# EAGLE design memory (EAGLE 6.6.0)
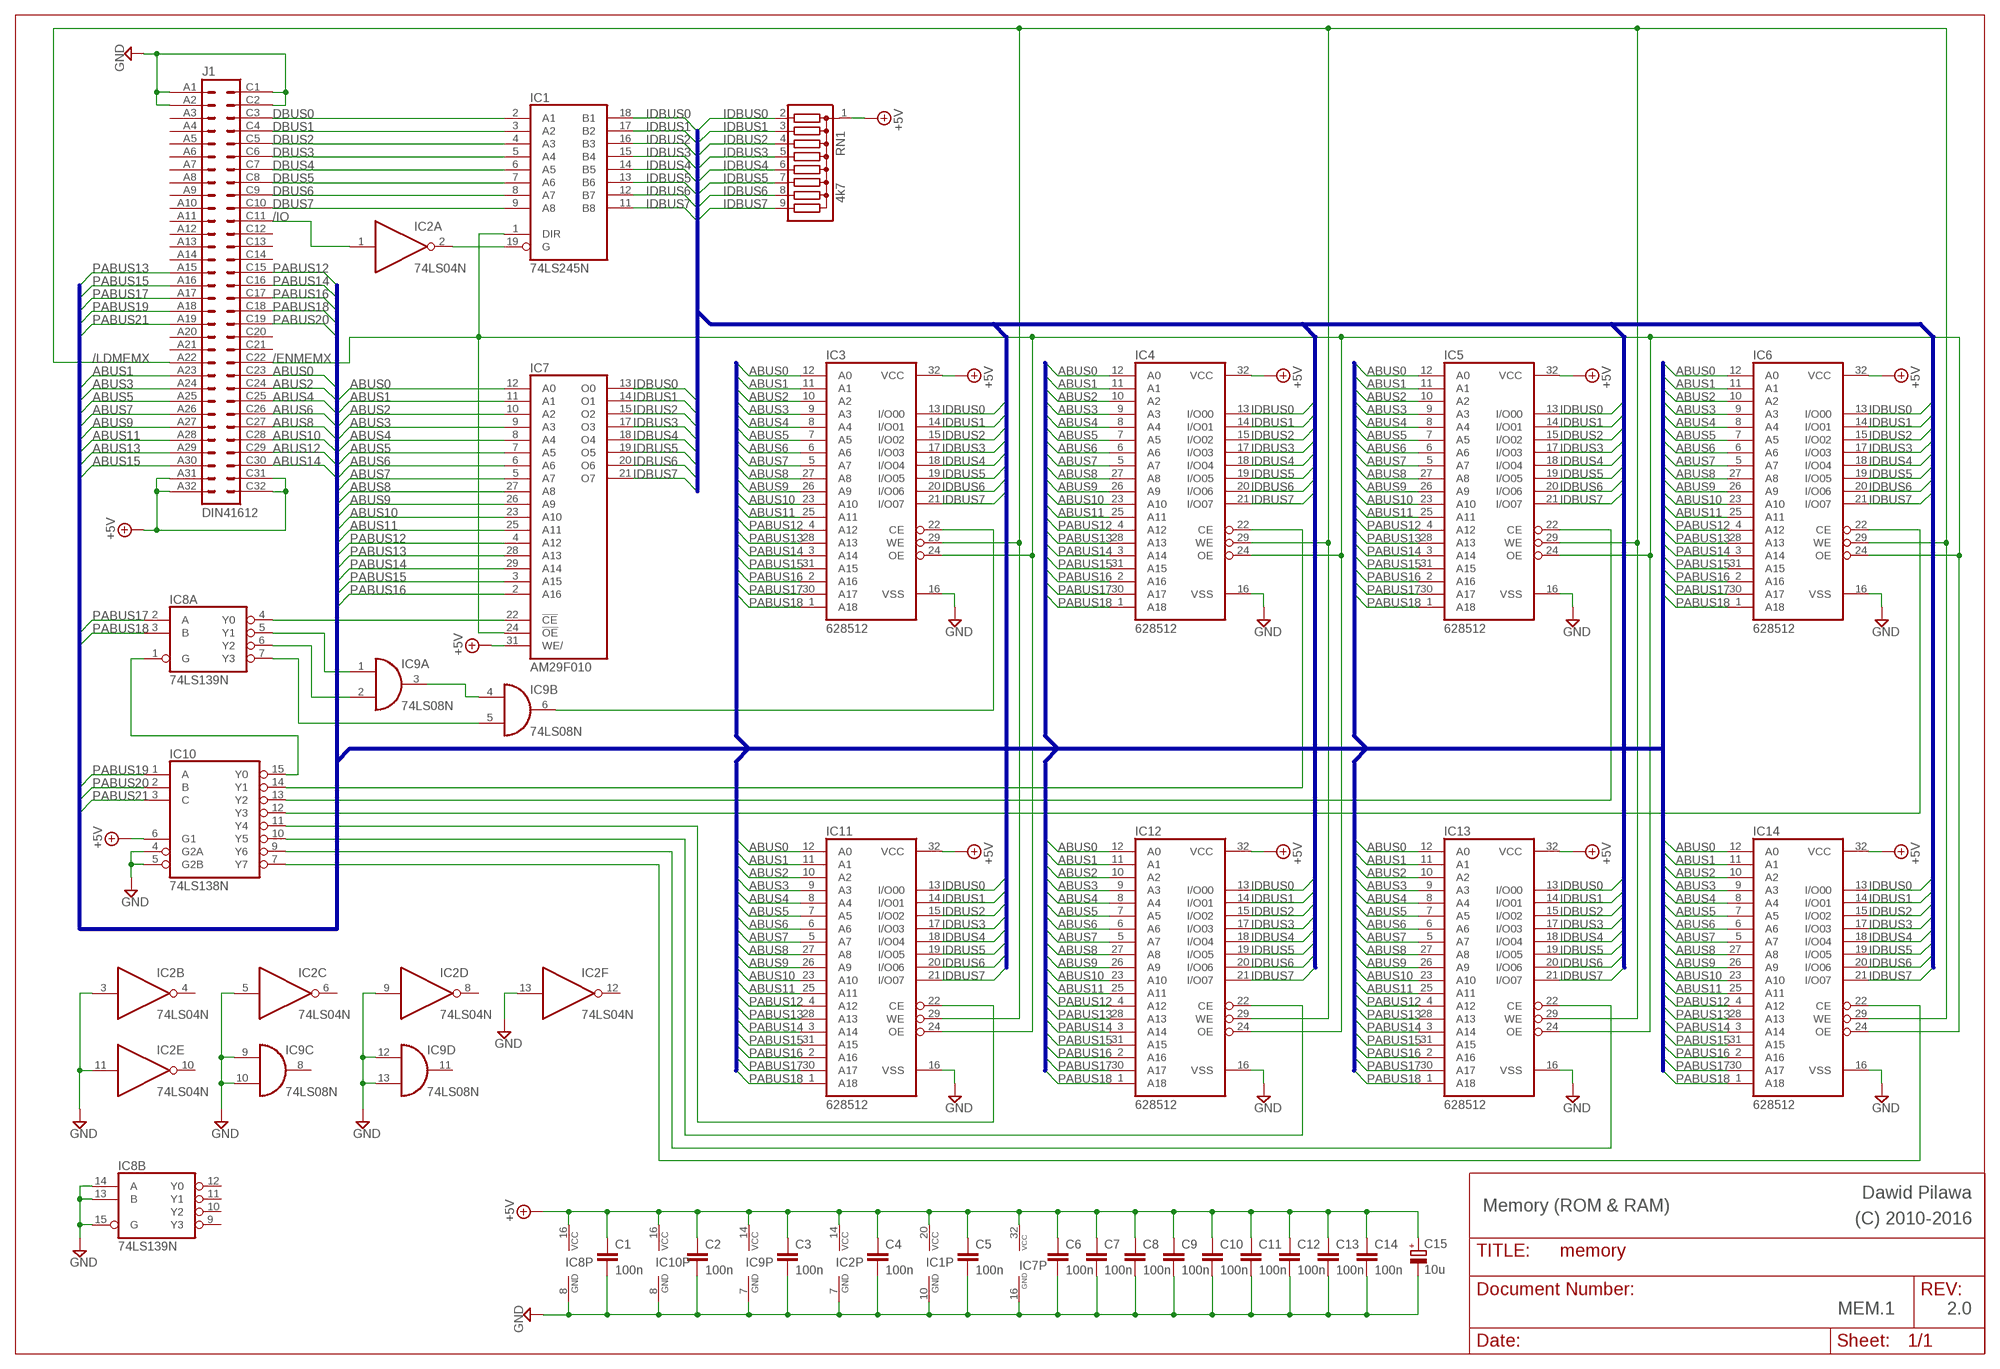
[diagram p0: schematic, sheet 1]

## Parts
C1  100n  C-EU050-024X044  [C050-024X044]
C2  100n  C-EU050-024X044  [C050-024X044]
C3  100n  C-EU050-024X044  [C050-024X044]
C4  100n  C-EU050-024X044  [C050-024X044]
C5  100n  C-EU050-024X044  [C050-024X044]
C6  100n  C-EU050-024X044  [C050-024X044]
C7  100n  C-EU050-024X044  [C050-024X044]
C8  100n  C-EU050-024X044  [C050-024X044]
C9  100n  C-EU050-024X044  [C050-024X044]
C10  100n  C-EU050-024X044  [C050-024X044]
C11  100n  C-EU050-024X044  [C050-024X044]
C12  100n  C-EU050-024X044  [C050-024X044]
C13  100n  C-EU050-024X044  [C050-024X044]
C14  100n  C-EU050-024X044  [C050-024X044]
C15  10u  CPOL-EUE2.5-6  [E2,5-6]
IC1  74LS245N  [DIL20]
IC2  74LS04N  [DIL14]
IC3  628512  HM628512A_DIL32  [DIL32]
IC4  628512  HM628512A_DIL32  [DIL32]
IC5  628512  HM628512A_DIL32  [DIL32]
IC6  628512  HM628512A_DIL32  [DIL32]
IC7  AM29F010  [DIL32-6]
IC8  74LS139N  [DIL16]
IC9  74LS08N  [DIL14]
IC10  74LS138N  [DIL16]
IC11  628512  HM628512A_DIL32  [DIL32]
IC12  628512  HM628512A_DIL32  [DIL32]
IC13  628512  HM628512A_DIL32  [DIL32]
IC14  628512  HM628512A_DIL32  [DIL32]
J1  DIN41612  VG64B  [VG64B]
RN1  4k7  G08R  [SIL9]

## Nets
+5V: C1.1 C2.1 C3.1 C4.1 C5.1 C6.1 C7.1 C8.1 C9.1 C10.1 C11.1 C12.1 C13.1 C14.1 C15.+ IC1.20(VCC) IC2.14(P:VCC) IC3.32(VCC) IC4.32(VCC) IC5.32(VCC) IC6.32(VCC) IC7.31(WE/) IC7.32(VCC) IC8.16(P:VCC) IC9.14(P:VCC) IC10.6(G1) IC10.16(VCC) IC11.32(VCC) IC12.32(VCC) IC13.32(VCC) IC14.32(VCC) J1.A31 J1.A32 J1.C31 J1.C32 RN1.1
/BANK0RAM: IC3.22(CE) IC9.6(B:O)
/BANK1: IC4.22(CE) IC10.14(Y1)
/BANK2: IC5.22(CE) IC10.13(Y2)
/BANK3: IC6.22(CE) IC10.12(Y3)
/BANK4: IC10.11(Y4) IC11.22(CE)
/BANK5: IC10.10(Y5) IC12.22(CE)
/BANK6: IC10.9(Y6) IC13.22(CE)
/BANK7: IC10.7(Y7) IC14.22(CE)
/ENMEMX: IC1.1(DIR) IC3.24(OE) IC4.24(OE) IC5.24(OE) IC6.24(OE) IC7.24(!OE) IC11.24(OE) IC12.24(OE) IC13.24(OE) IC14.24(OE) J1.C22
/IO: IC2.1(A:I) J1.C11
/LDMEMX: IC3.29(WE) IC4.29(WE) IC5.29(WE) IC6.29(WE) IC11.29(WE) IC12.29(WE) IC13.29(WE) IC14.29(WE) J1.A22
ABUS0: IC3.12(A0) IC4.12(A0) IC5.12(A0) IC6.12(A0) IC7.12(A0) IC11.12(A0) IC12.12(A0) IC13.12(A0) IC14.12(A0) J1.C23
ABUS1: IC3.11(A1) IC4.11(A1) IC5.11(A1) IC6.11(A1) IC7.11(A1) IC11.11(A1) IC12.11(A1) IC13.11(A1) IC14.11(A1) J1.A23
ABUS2: IC3.10(A2) IC4.10(A2) IC5.10(A2) IC6.10(A2) IC7.10(A2) IC11.10(A2) IC12.10(A2) IC13.10(A2) IC14.10(A2) J1.C24
ABUS3: IC3.9(A3) IC4.9(A3) IC5.9(A3) IC6.9(A3) IC7.9(A3) IC11.9(A3) IC12.9(A3) IC13.9(A3) IC14.9(A3) J1.A24
ABUS4: IC3.8(A4) IC4.8(A4) IC5.8(A4) IC6.8(A4) IC7.8(A4) IC11.8(A4) IC12.8(A4) IC13.8(A4) IC14.8(A4) J1.C25
ABUS5: IC3.7(A5) IC4.7(A5) IC5.7(A5) IC6.7(A5) IC7.7(A5) IC11.7(A5) IC12.7(A5) IC13.7(A5) IC14.7(A5) J1.A25
ABUS6: IC3.6(A6) IC4.6(A6) IC5.6(A6) IC6.6(A6) IC7.6(A6) IC11.6(A6) IC12.6(A6) IC13.6(A6) IC14.6(A6) J1.C26
ABUS7: IC3.5(A7) IC4.5(A7) IC5.5(A7) IC6.5(A7) IC7.5(A7) IC11.5(A7) IC12.5(A7) IC13.5(A7) IC14.5(A7) J1.A26
ABUS8: IC3.27(A8) IC4.27(A8) IC5.27(A8) IC6.27(A8) IC7.27(A8) IC11.27(A8) IC12.27(A8) IC13.27(A8) IC14.27(A8) J1.C27
ABUS9: IC3.26(A9) IC4.26(A9) IC5.26(A9) IC6.26(A9) IC7.26(A9) IC11.26(A9) IC12.26(A9) IC13.26(A9) IC14.26(A9) J1.A27
ABUS10: IC3.23(A10) IC4.23(A10) IC5.23(A10) IC6.23(A10) IC7.23(A10) IC11.23(A10) IC12.23(A10) IC13.23(A10) IC14.23(A10) J1.C28
ABUS11: IC3.25(A11) IC4.25(A11) IC5.25(A11) IC6.25(A11) IC7.25(A11) IC11.25(A11) IC12.25(A11) IC13.25(A11) IC14.25(A11) J1.A28
ABUS12: J1.C29
ABUS13: J1.A29
ABUS14: J1.C30
ABUS15: J1.A30
DBUS0: IC1.2(A1) J1.C3
DBUS1: IC1.3(A2) J1.C4
DBUS2: IC1.4(A3) J1.C5
DBUS3: IC1.5(A4) J1.C6
DBUS4: IC1.6(A5) J1.C7
DBUS5: IC1.7(A6) J1.C8
DBUS6: IC1.8(A7) J1.C9
DBUS7: IC1.9(A8) J1.C10
GND: C1.2 C2.2 C3.2 C4.2 C5.2 C6.2 C7.2 C8.2 C9.2 C10.2 C11.2 C12.2 C13.2 C14.2 C15.- IC1.10(GND) IC2.3(B:I) IC2.5(C:I) IC2.7(P:GND) IC2.9(D:I) IC2.11(E:I) IC2.13(F:I) IC3.16(VSS) IC4.16(VSS) IC5.16(VSS) IC6.16(VSS) IC7.16(GND) IC8.8(P:GND) IC8.13(B:B) IC8.14(B:A) IC8.15(B:G) IC9.7(P:GND) IC9.9(C:I0) IC9.10(C:I1) IC9.12(D:I0) IC9.13(D:I1) IC10.4(G2A) IC10.5(G2B) IC10.8(GND) IC11.16(VSS) IC12.16(VSS) IC13.16(VSS) IC14.16(VSS) J1.A1 J1.A2 J1.C1 J1.C2
IDBUS0: IC1.18(B1) IC3.13(I/O00) IC4.13(I/O00) IC5.13(I/O00) IC6.13(I/O00) IC7.13(O0) IC11.13(I/O00) IC12.13(I/O00) IC13.13(I/O00) IC14.13(I/O00) RN1.2
IDBUS1: IC1.17(B2) IC3.14(I/O01) IC4.14(I/O01) IC5.14(I/O01) IC6.14(I/O01) IC7.14(O1) IC11.14(I/O01) IC12.14(I/O01) IC13.14(I/O01) IC14.14(I/O01) RN1.3
IDBUS2: IC1.16(B3) IC3.15(I/O02) IC4.15(I/O02) IC5.15(I/O02) IC6.15(I/O02) IC7.15(O2) IC11.15(I/O02) IC12.15(I/O02) IC13.15(I/O02) IC14.15(I/O02) RN1.4
IDBUS3: IC1.15(B4) IC3.17(I/O03) IC4.17(I/O03) IC5.17(I/O03) IC6.17(I/O03) IC7.17(O3) IC11.17(I/O03) IC12.17(I/O03) IC13.17(I/O03) IC14.17(I/O03) RN1.5
IDBUS4: IC1.14(B5) IC3.18(I/O04) IC4.18(I/O04) IC5.18(I/O04) IC6.18(I/O04) IC7.18(O4) IC11.18(I/O04) IC12.18(I/O04) IC13.18(I/O04) IC14.18(I/O04) RN1.6
IDBUS5: IC1.13(B6) IC3.19(I/O05) IC4.19(I/O05) IC5.19(I/O05) IC6.19(I/O05) IC7.19(O5) IC11.19(I/O05) IC12.19(I/O05) IC13.19(I/O05) IC14.19(I/O05) RN1.7
IDBUS6: IC1.12(B7) IC3.20(I/O06) IC4.20(I/O06) IC5.20(I/O06) IC6.20(I/O06) IC7.20(O6) IC11.20(I/O06) IC12.20(I/O06) IC13.20(I/O06) IC14.20(I/O06) RN1.8
IDBUS7: IC1.11(B8) IC3.21(I/O07) IC4.21(I/O07) IC5.21(I/O07) IC6.21(I/O07) IC7.21(O7) IC11.21(I/O07) IC12.21(I/O07) IC13.21(I/O07) IC14.21(I/O07) RN1.9
N$1: IC1.19(G) IC2.2(A:O)
N$3: IC8.1(A:G) IC10.15(Y0)
N$4: IC8.5(A:Y1) IC9.1(A:I0)
N$5: IC8.6(A:Y2) IC9.2(A:I1)
N$6: IC7.22(!CE) IC8.4(A:Y0)
N$7: IC8.7(A:Y3) IC9.5(B:I1)
N$8: IC9.3(A:O) IC9.4(B:I0)
PABUS12: IC3.4(A12) IC4.4(A12) IC5.4(A12) IC6.4(A12) IC7.4(A12) IC11.4(A12) IC12.4(A12) IC13.4(A12) IC14.4(A12) J1.C15
PABUS13: IC3.28(A13) IC4.28(A13) IC5.28(A13) IC6.28(A13) IC7.28(A13) IC11.28(A13) IC12.28(A13) IC13.28(A13) IC14.28(A13) J1.A15
PABUS14: IC3.3(A14) IC4.3(A14) IC5.3(A14) IC6.3(A14) IC7.29(A14) IC11.3(A14) IC12.3(A14) IC13.3(A14) IC14.3(A14) J1.C16
PABUS15: IC3.31(A15) IC4.31(A15) IC5.31(A15) IC6.31(A15) IC7.3(A15) IC11.31(A15) IC12.31(A15) IC13.31(A15) IC14.31(A15) J1.A16
PABUS16: IC3.2(A16) IC4.2(A16) IC5.2(A16) IC6.2(A16) IC7.2(A16) IC11.2(A16) IC12.2(A16) IC13.2(A16) IC14.2(A16) J1.C17
PABUS17: IC3.30(A17) IC4.30(A17) IC5.30(A17) IC6.30(A17) IC8.2(A:A) IC11.30(A17) IC12.30(A17) IC13.30(A17) IC14.30(A17) J1.A17
PABUS18: IC3.1(A18) IC4.1(A18) IC5.1(A18) IC6.1(A18) IC8.3(A:B) IC11.1(A18) IC12.1(A18) IC13.1(A18) IC14.1(A18) J1.C18
PABUS19: IC10.1(A) J1.A18
PABUS20: IC10.2(B) J1.C19
PABUS21: IC10.3(C) J1.A19
Unconnected: IC2.4(B:O) IC2.6(C:O) IC2.8(D:O) IC2.10(E:O) IC2.12(F:O) IC7.1(NC) IC7.30(NC) IC8.9(B:Y3) IC8.10(B:Y2) IC8.11(B:Y1) IC8.12(B:Y0) IC9.8(C:O) IC9.11(D:O) J1.A3 J1.A4 J1.A5 J1.A6 J1.A7 J1.A8 J1.A9 J1.A10 J1.A11 J1.A12 J1.A13 J1.A14 J1.A20 J1.A21 J1.C12 J1.C13 J1.C14 J1.C20 J1.C21

## Buses
ABUS[0..15],PABUS[12..21]
IDBUS[0..7]

## Notes on the sheet
- Dawid Pilawa
- Memory (ROM & RAM) | (C) 2010-2016
- MEM.1 | 2.0

## Library data of the parts
C1-C14 = rcl:C-EU: CAPACITOR, European symbol
C15 = rcl:CPOL-EU: POLARIZED CAPACITOR, European symbol
IC1 = 74xx-eu:74*245: Octal BUS TRANSCEIVER, 3-state
IC2 = 74xx-eu:74*04: Hex INVERTER
IC3-IC6 IC11-IC14 = hitachi_sram_hm628512a-series_rev1:HM628512A_DIL32: 4M SRAM 512kword x 8bit
IC7 = am29-memory:AM29F010*: 1-Megabit FLASH MEMORY (128 K x 8 bit) 5 V-only
IC8 = 74xx-eu:74*139: Dual 2-line to 4-line DECODER/DEMULTIPLEXER
IC9 = 74xx-eu:74*08: Quad 2-input AND gate
IC10 = 74xx-eu:74*138: 3-line to 8-line DECODER/DEMULTIPLEXER
J1 = 19inch:VG64: PCB EUROCARD, 64-pin type C/AC, 2.54 mm
RN1 = resistor-sil:G08R: SIL RESISTOR

## Board
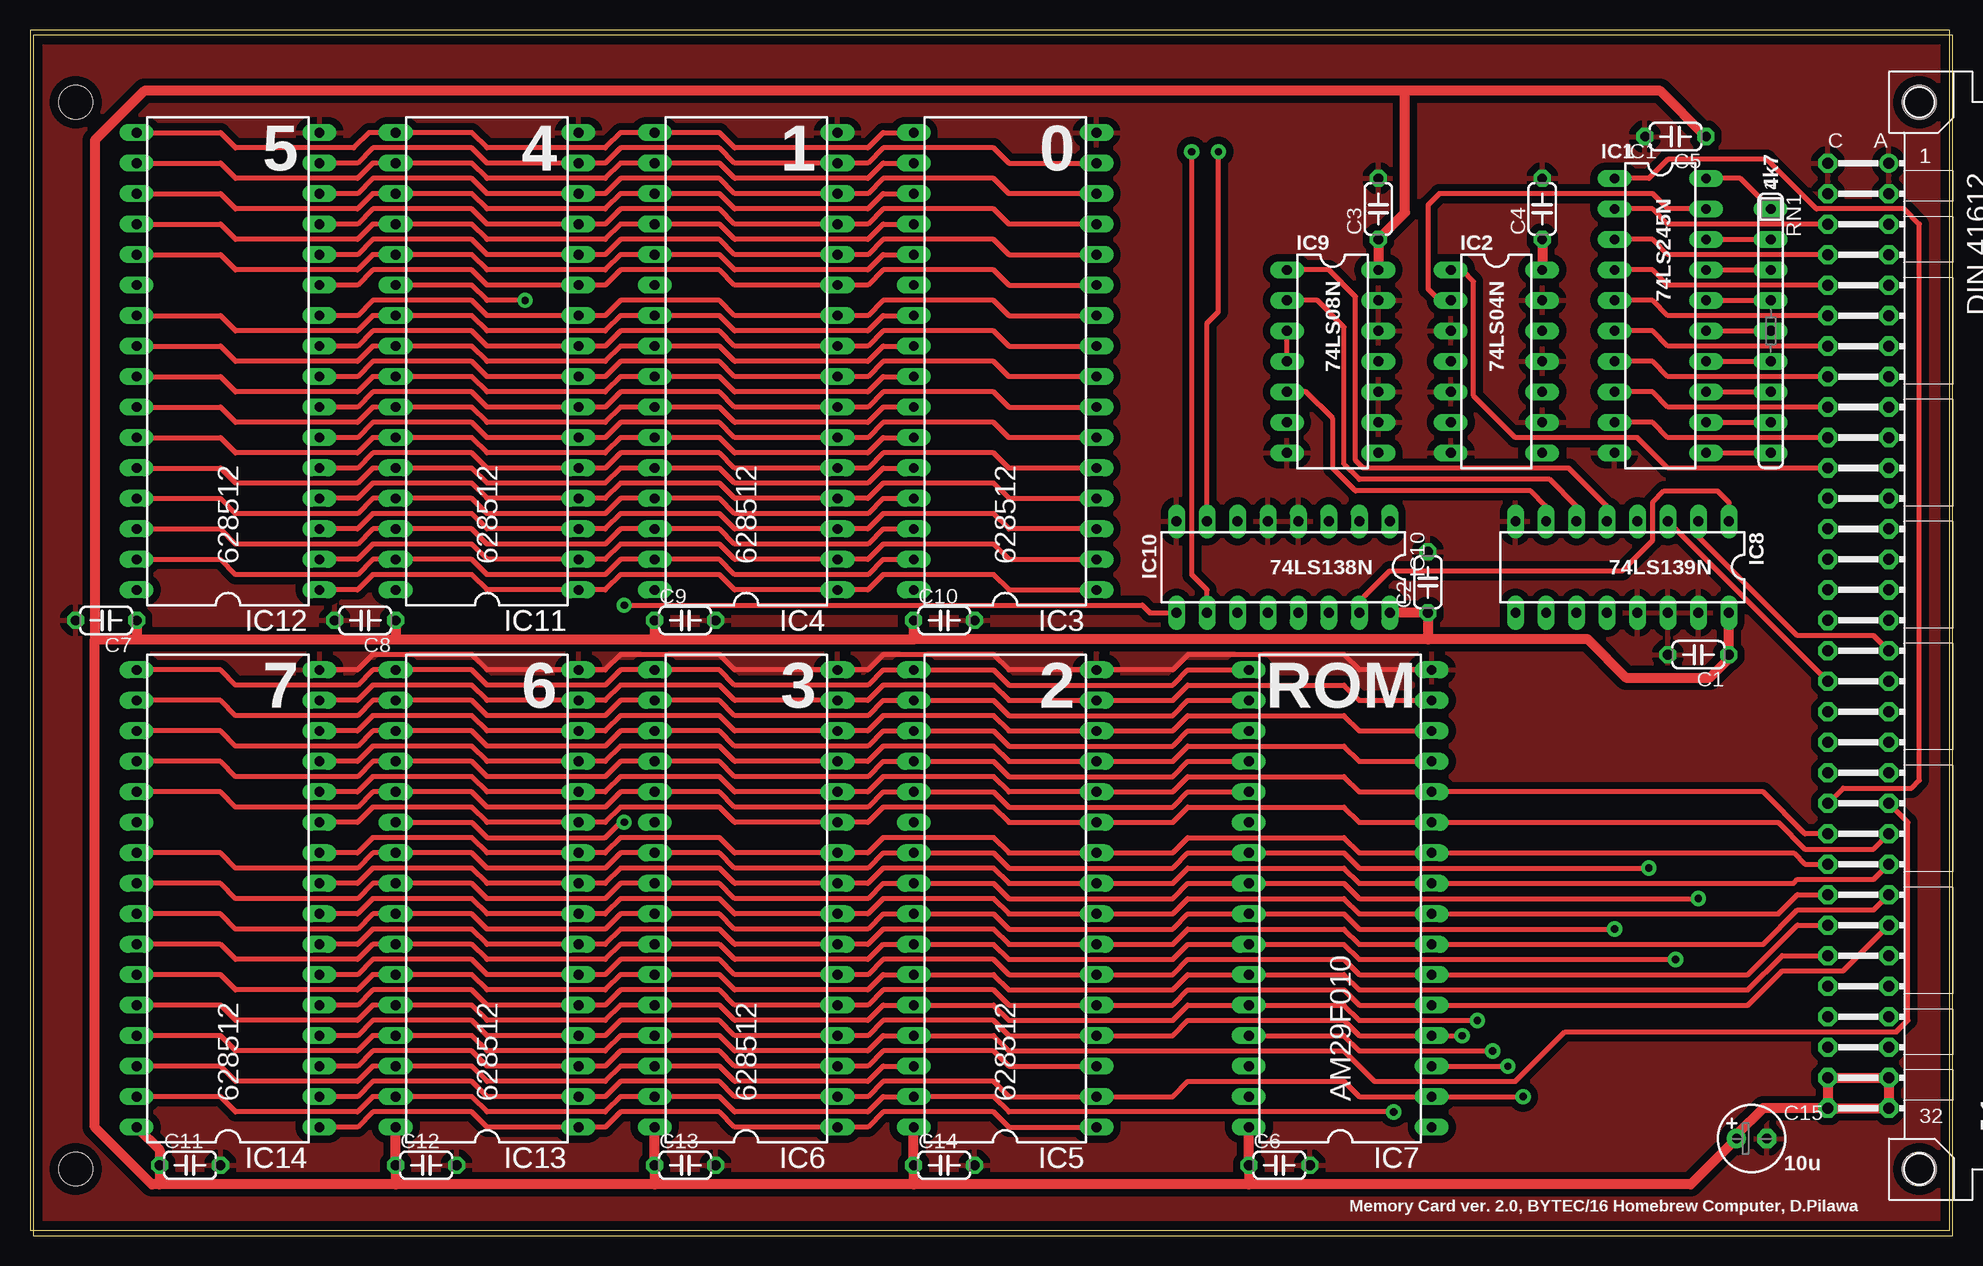
[diagram p1: board, top side]
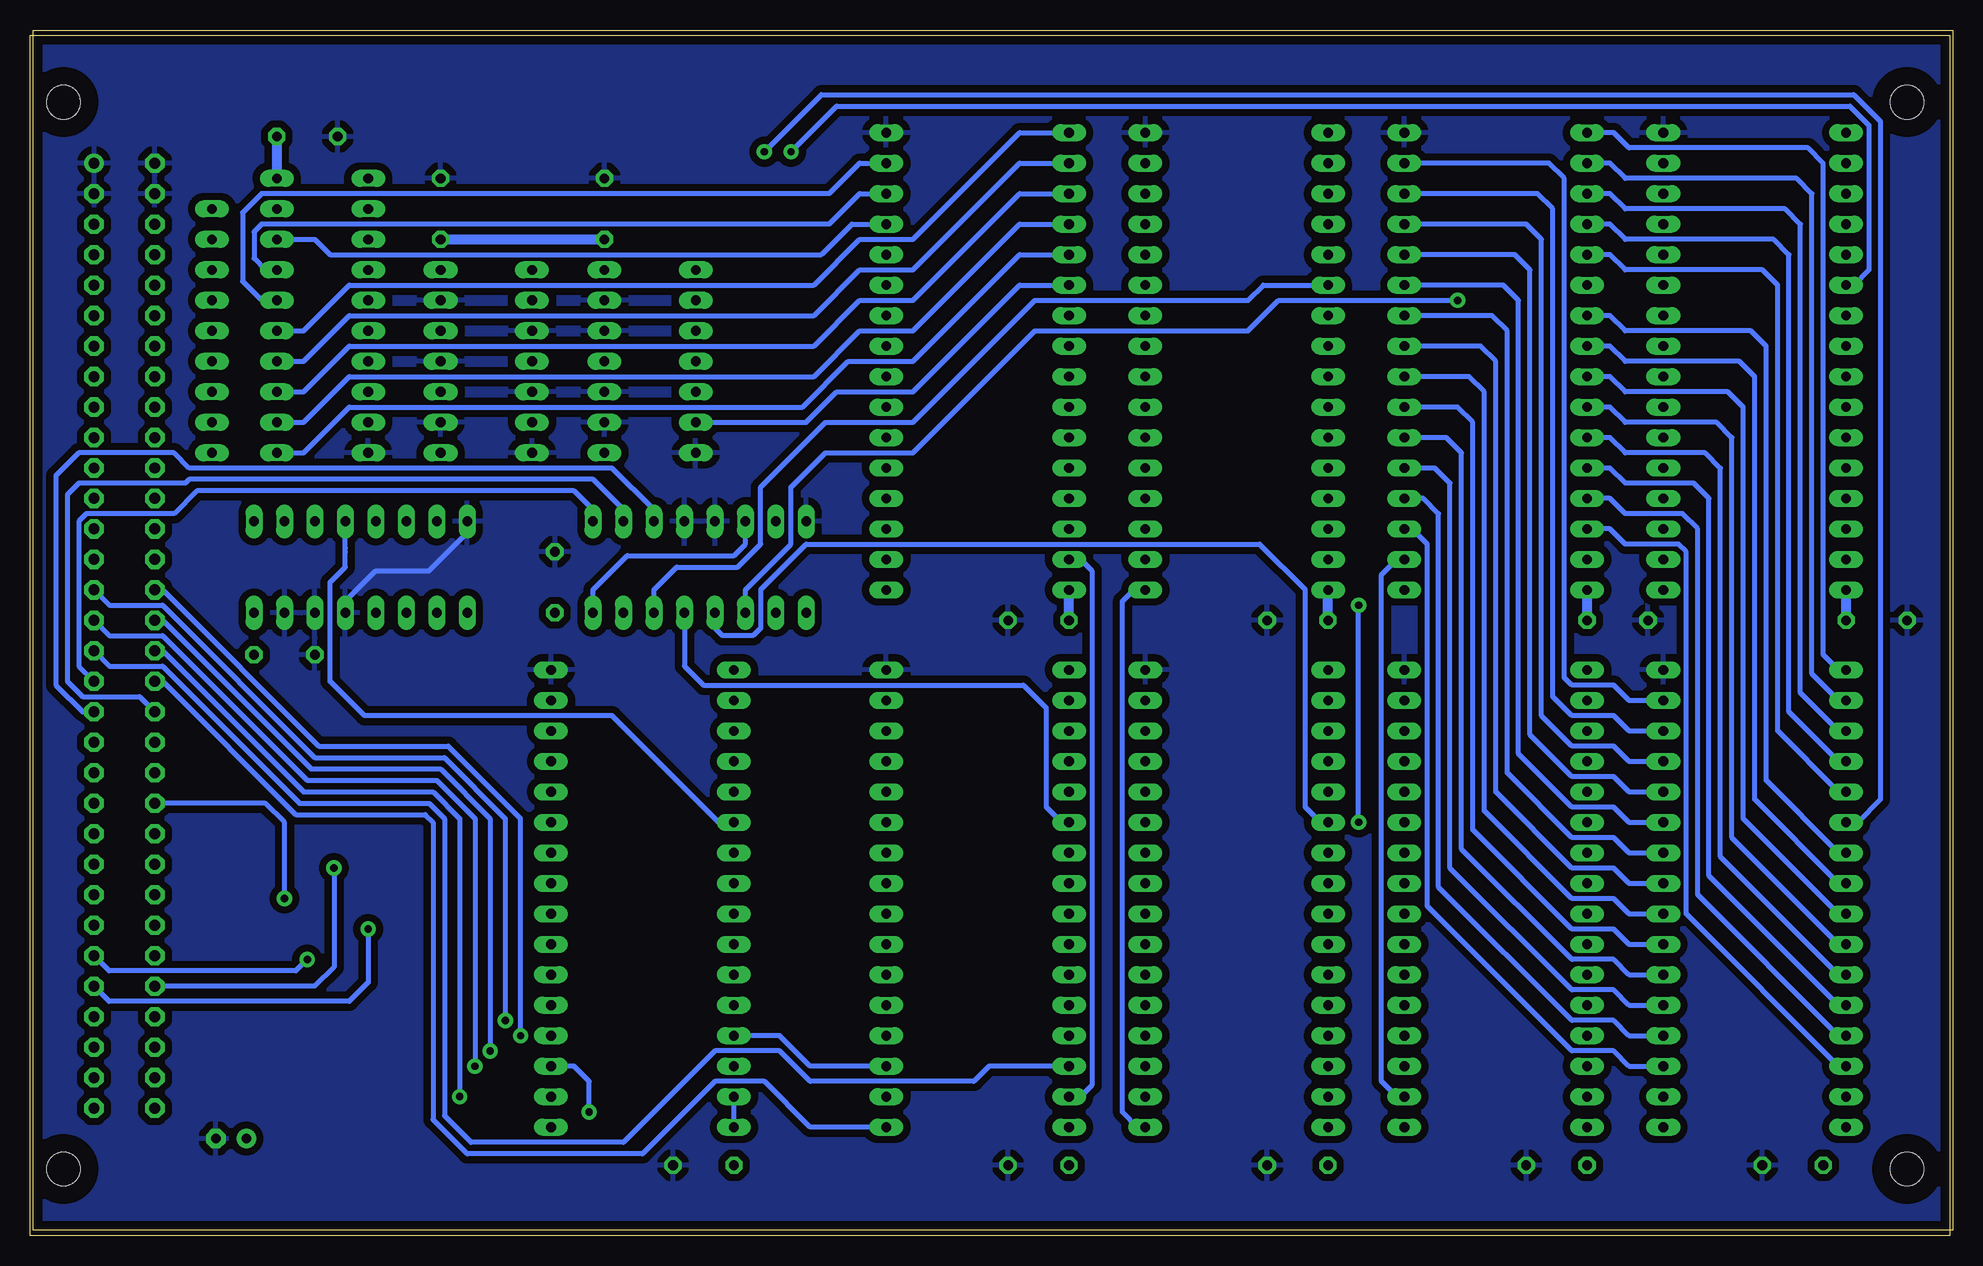
[diagram p2: board, bottom side, seen from below]

Size 160 x 100 mm. Coordinates in mm from the lower left corner, seen from the top.
Outline: 0,0 160,0 160,100 0,100 0,0
Copper layers (1*16): Top 0.035mm / dielectric 1.5mm / Bottom 0.035mm
Design rules "homebrew_pcb": minimum track width 16mil, minimum drill 24mil, track to track 16mil, track to pad 10mil, pad to pad 10mil, via to via 10mil, smd to smd 8mil, copper to edge 30mil, drill to drill 10mil, minimum pad ring 12mil, minimum via ring 12mil, stop-mask expansion 4mil, vias tented up to drill 0mil, thermal gap 24mil

### Footprints (pad centres in the part's own frame; a part is rotated, then mirrored left to right if it is on the bottom)
C050-024X044 = drill 0.813 octagon: 1 -2.54,0; 2 2.54,0
E2,5-6 = drill 0.813 pad 1.6: + -1.27,0 | drill 0.813 pad 1.6 octagon: - 1.27,0
DIL20 = drill 0.813 long: 1 -11.43,-3.81; 2 -8.89,-3.81; 3 -6.35,-3.81; 4 -3.81,-3.81; 5 -1.27,-3.81; 6 1.27,-3.81; 7 3.81,-3.81; 8 6.35,-3.81; 9 8.89,-3.81; 10 11.43,-3.81; 11 11.43,3.81; 12 8.89,3.81; 13 6.35,3.81; 14 3.81,3.81; 15 1.27,3.81; 16 -1.27,3.81; 17 -3.81,3.81; 18 -6.35,3.81; 19 -8.89,3.81; 20 -11.43,3.81
DIL14 = drill 0.813 long: 1 -7.62,-3.81; 2 -5.08,-3.81; 3 -2.54,-3.81; 4 0,-3.81; 5 2.54,-3.81; 6 5.08,-3.81; 7 7.62,-3.81; 8 7.62,3.81; 9 5.08,3.81; 10 2.54,3.81; 11 0,3.81; 12 -2.54,3.81; 13 -5.08,3.81; 14 -7.62,3.81
DIL32 = drill 0.813 long: 1 -17.78,-7.62; 2 -15.24,-7.62; 3 -12.7,-7.62; 4 -10.16,-7.62; 5 -7.62,-7.62; 6 -5.08,-7.62; 7 -2.54,-7.62; 8 0,-7.62; 9 2.54,-7.62; 10 5.08,-7.62; 11 7.62,-7.62; 12 10.16,-7.62; 13 12.7,-7.62; 14 15.24,-7.62; 15 17.78,-7.62; 16 20.32,-7.62; 17 20.32,7.62; 18 17.78,7.62; 19 15.24,7.62; 20 12.7,7.62; 21 10.16,7.62; 22 7.62,7.62; 23 5.08,7.62; 24 2.54,7.62; 25 0,7.62; 26 -2.54,7.62; 27 -5.08,7.62; 28 -7.62,7.62; 29 -10.16,7.62; 30 -12.7,7.62; 31 -15.24,7.62; 32 -17.78,7.62
DIL32-6 = drill 0.813 long: 1 -17.78,-7.62; 2 -15.24,-7.62; 3 -12.7,-7.62; 4 -10.16,-7.62; 5 -7.62,-7.62; 6 -5.08,-7.62; 7 -2.54,-7.62; 8 0,-7.62; 9 2.54,-7.62; 10 5.08,-7.62; 11 7.62,-7.62; 12 10.16,-7.62; 13 12.7,-7.62; 14 15.24,-7.62; 15 17.78,-7.62; 16 20.32,-7.62; 17 20.32,7.62; 18 17.78,7.62; 19 15.24,7.62; 20 12.7,7.62; 21 10.16,7.62; 22 7.62,7.62; 23 5.08,7.62; 24 2.54,7.62; 25 0,7.62; 26 -2.54,7.62; 27 -5.08,7.62; 28 -7.62,7.62; 29 -10.16,7.62; 30 -12.7,7.62; 31 -15.24,7.62; 32 -17.78,7.62
DIL16 = drill 0.813 long: 1 -8.89,-3.81; 2 -6.35,-3.81; 3 -3.81,-3.81; 4 -1.27,-3.81; 5 1.27,-3.81; 6 3.81,-3.81; 7 6.35,-3.81; 8 8.89,-3.81; 9 8.89,3.81; 10 6.35,3.81; 11 3.81,3.81; 12 1.27,3.81; 13 -1.27,3.81; 14 -3.81,3.81; 15 -6.35,3.81; 16 -8.89,3.81
VG64B = drill 0.914 pad 1.6: A1 154.94,39.37 | drill 0.914 pad 1.6 octagon: A2 154.94,36.83; A3 154.94,34.29; A4 154.94,31.75; A5 154.94,29.21; A6 154.94,26.67; A7 154.94,24.13; A8 154.94,21.59; A9 154.94,19.05; A10 154.94,16.51; A11 154.94,13.97; A12 154.94,11.43; A13 154.94,8.89; A14 154.94,6.35; A15 154.94,3.81; A16 154.94,1.27; A17 154.94,-1.27; A18 154.94,-3.81; A19 154.94,-6.35; A20 154.94,-8.89; A21 154.94,-11.43; A22 154.94,-13.97; A23 154.94,-16.51; A24 154.94,-19.05; A25 154.94,-21.59; A26 154.94,-24.13; A27 154.94,-26.67; A28 154.94,-29.21; A29 154.94,-31.75; A30 154.94,-34.29; A31 154.94,-36.83; A32 154.94,-39.37; C1 149.86,39.37; C2 149.86,36.83; C3 149.86,34.29; C4 149.86,31.75; C5 149.86,29.21; C6 149.86,26.67; C7 149.86,24.13; C8 149.86,21.59; C9 149.86,19.05; C10 149.86,16.51; C11 149.86,13.97; C12 149.86,11.43; C13 149.86,8.89; C14 149.86,6.35; C15 149.86,3.81; C16 149.86,1.27; C17 149.86,-1.27; C18 149.86,-3.81; C19 149.86,-6.35; C20 149.86,-8.89; C21 149.86,-11.43; C22 149.86,-13.97; C23 149.86,-16.51; C24 149.86,-19.05; C25 149.86,-21.59; C26 149.86,-24.13; C27 149.86,-26.67; C28 149.86,-29.21; C29 149.86,-31.75; C30 149.86,-34.29; C31 149.86,-36.83; C32 149.86,-39.37 | hole 2.794: 157.48,44.45; 157.48,-44.45; 3.81,-44.45; 3.81,44.45
SIL9 = drill 0.813 long: 1 -10.16,0; 2 -7.62,0; 3 -5.08,0; 4 -2.54,0; 5 0,0; 6 2.54,0; 7 5.08,0; 8 7.62,0; 9 10.16,0

### Placement (x,y rotation side)
C1  139.06,47.94 180 top
C2  116.52,53.98 90 top
C3  112.39,85.09 90 top
C4  126.05,85.09 90 top
C5  137.16,91.12 180 top
C6  104.14,5.4 0 top
C7  6.35,50.8 180 top
C8  27.94,50.8 180 top
C9  54.61,50.8 0 top
C10  76.2,50.8 0 top
C11  13.34,5.4 0 top
C12  33.02,5.4 0 top
C13  54.61,5.4 0 top
C14  76.2,5.4 0 top
C15  143.51,7.62 0 top
IC1  135.89,76.2 270 top
IC2  122.24,72.39 270 top
IC3  81.28,71.12 90 top
IC4  59.69,71.12 90 top
IC5  81.28,26.35 90 top
IC6  59.69,26.35 90 top
IC7  109.22,26.35 90 top
IC8  132.72,55.24 180 top
IC9  108.58,72.39 270 top
IC10  104.46,55.24 180 top
IC11  38.1,71.12 90 top
IC12  16.51,71.12 90 top
IC13  38.1,26.35 90 top
IC14  16.51,26.35 90 top
J1  0,49.53 0 top
RN1  145.1,74.93 270 top

### Tracks (layer width: path | path; a pad name or v marks a point on that pad's centre or on a via)
+5V
  Top 0.406: RN1.1 142.56,87.63 IC1.20
  Top 0.813: J1.C32 J1.C31 J1.A31 J1.A32 J1.C32 | J1.C32 144.46,10.16 142.24,7.94 C15.+ 138.43,3.81 101.6,3.81 | 101.6,3.81 73.66,3.81 | 73.66,3.81 52.07,3.81 | 52.07,3.81 30.48,3.81 | 30.48,3.81 10.79,3.81 | 10.79,3.81 10.16,3.81 5.4,8.57 5.4,49.21 | C7.1 8.89,49.21 | 5.4,49.21 8.89,49.21 | 8.89,49.21 30.48,49.21 | 30.48,49.21 52.07,49.21 | 52.07,49.21 73.66,49.21 | C5.1 135.89,94.93 114.62,94.93 | 114.62,94.93 9.53,94.93 5.4,90.81 5.4,49.21 | 10.79,3.81 C11.1 10.79,6.67 IC14.32 | 30.48,3.81 C12.1 IC13.32 | 52.07,3.81 C13.1 IC6.32 | 73.66,3.81 C14.1 IC5.32 | 101.6,3.81 C6.1 IC7.32 | C4.1 IC2.14 | 114.62,94.93 114.62,84.77 C3.1 IC9.14 | C8.1 30.48,49.21 | C9.1 52.07,49.21 | C10.1 73.66,49.21 | 116.52,49.21 129.86,49.21 133.03,46.04 140.02,46.04 141.6,47.62 C1.1 IC8.16 | 116.52,49.21 73.66,49.21 | 116.52,49.21 C2.1 IC10.16
  Bottom 0.406: IC10.16 113.35,53.34 110.49,56.2 101.6,56.2 100.65,57.15 IC10.6 | IC7.32 IC7.31
  Bottom 0.813: C5.1 IC1.20 | C4.1 C3.1 | C7.1 IC12.32 | C8.1 IC11.32 | C9.1 IC4.32 | C10.1 IC3.32
/BANK0RAM
  Bottom 0.406: IC9.6 95.57,67.31 93.03,69.85 86.68,69.85 77.79,78.74 IC3.22
/BANK1
  Bottom 0.406: IC10.14 108.27,53.34 106.36,55.24 101.28,55.24 99.38,57.15 99.38,61.91 93.98,67.31 86.68,67.31 76.52,77.47 58.74,77.47 57.47,78.74 IC4.22
/BANK2
  Bottom 0.406: IC5.22 74.3,33.97 75.56,35.24 75.56,43.5 77.47,45.4 104.14,45.4 105.73,46.99 IC10.13
/BANK3
  Bottom 0.406: IC6.22 52.7,33.97 53.98,35.24 53.98,53.34 57.78,57.15 95.57,57.15 99.38,53.34 99.38,50.16 100.01,49.53 102.55,49.53 103.19,50.16 IC10.12
/BANK4  (via drill 0.61 pad 1.27)
  Top 0.406: v41.27,77.47 38.1,77.47 36.83,78.74 IC11.22
  Bottom 0.406: IC10.11 100.65,53.34 96.84,57.15 96.84,61.91 93.98,64.77 86.68,64.77 76.52,74.93 58.74,74.93 56.2,77.47 v41.27,77.47
/BANK5  (via drill 0.61 pad 1.27)
  Top 0.406: IC10.10 98.11,53.34 96.84,54.61 v96.84,89.85
  Bottom 0.406: v96.84,89.85 93.03,93.66 8.57,93.66 6.99,92.08 6.99,80.01 8.26,78.74 IC12.22
/BANK6  (via drill 0.61 pad 1.27)
  Top 0.406: IC13.22 36.83,33.97 38.1,32.7 47.94,32.7 49.21,33.97 v49.53,33.97 | v49.53,52.07 92.71,52.07 93.34,51.44 IC10.9
  Bottom 0.406: v49.53,33.97 v49.53,52.07
/BANK7  (via drill 0.61 pad 1.27)
  Top 0.406: IC10.7 98.11,75.56 99.06,76.52 v99.06,89.85
  Bottom 0.406: v99.06,89.85 94.3,94.61 8.26,94.61 6.03,92.39 6.03,35.88 7.94,33.97 IC14.22
/ENMEMX  (via drill 0.61 pad 1.27)
  Top 0.406: IC3.24 71.12,73.66 69.85,72.39 58.74,72.39 57.47,73.66 IC4.24 49.21,73.66 47.94,72.39 38.1,72.39 36.83,73.66 IC11.24 28.57,73.66 27.3,72.39 17.14,72.39 15.88,73.66 IC12.24 | IC14.24 15.88,28.89 17.14,27.62 27.3,27.62 28.57,28.89 IC13.24 36.83,28.89 38.1,27.62 47.94,27.62 49.21,28.89 IC6.24 57.47,28.89 58.74,27.62 69.85,27.62 71.12,28.89 IC5.24 80.33,28.89 81.6,27.62 95.25,27.62 96.52,28.89 IC7.24 109.54,28.89 110.81,27.62 v139.06,27.62 | J1.C22 151.13,36.83 156.84,36.83 157.48,37.47 157.48,83.82 156.21,85.09 148.91,85.09 144.78,89.22 136.53,89.22 134.94,87.63 IC1.1
  Bottom 0.406: IC11.24 28.57,73.66 27.3,72.39 17.78,72.39 16.51,71.12 16.51,35.88 9.53,28.89 IC14.24 | v139.06,27.62 139.06,33.97 140.65,35.56 J1.C22
/IO
  Top 0.406: J1.C11 136.53,63.5 133.99,66.04 123.83,66.04 120.33,69.53 120.33,79.06 119.38,80.01 IC2.1
/LDMEMX
  Top 0.406: IC3.29 71.12,60.96 69.85,59.69 58.74,59.69 57.47,60.96 IC4.29 49.21,60.96 47.94,59.69 38.1,59.69 36.83,60.96 IC11.29 28.57,60.96 27.3,59.69 17.14,59.69 15.88,60.96 IC12.29 | IC14.29 15.88,16.19 17.14,14.92 27.3,14.92 28.57,16.19 IC13.29 36.83,16.19 38.1,14.92 47.94,14.92 49.21,16.19 IC6.29 57.47,16.19 58.74,14.92 69.85,14.92 71.12,16.19 IC5.29 80.33,16.19 81.6,14.92 109.54,14.92 112.08,12.38 123.83,12.38 127.95,16.51 155.57,16.51 156.53,17.46 156.53,33.97 J1.A22
  Bottom 0.406: IC11.29 28.57,60.96 27.3,59.69 22.54,59.69 21.27,58.42 21.27,27.94 9.53,16.19 IC14.29
ABUS0
  Top 0.406: IC3.12 81.6,81.28 80.33,82.55 71.12,82.55 69.85,81.28 IC4.12 58.74,81.28 57.47,82.55 49.21,82.55 47.94,81.28 IC11.12 38.1,81.28 36.83,82.55 28.57,82.55 27.3,81.28 IC12.12 | IC14.12 27.3,36.51 28.57,37.78 36.83,37.78 38.1,36.51 IC13.12 47.94,36.51 49.21,37.78 57.47,37.78 58.74,36.51 IC6.12 69.85,36.51 71.12,37.78 80.33,37.78 81.6,36.51 IC5.12 95.25,36.51 96.52,37.78 109.54,37.78 110.81,36.51 IC7.12 144.46,36.51 147.96,33.02 J1.C23
  Bottom 0.406: IC11.12 36.51,81.28 35.24,80.01 35.24,41.27 31.75,37.78 28.26,37.78 26.99,36.51 IC14.12
ABUS1
  Top 0.406: IC3.11 81.6,78.74 80.33,80.01 71.12,80.01 69.85,78.74 IC4.11 58.74,78.74 57.47,80.01 49.21,80.01 47.94,78.74 IC11.11 38.1,78.74 36.83,80.01 28.57,80.01 27.3,78.74 IC12.11 | IC14.11 27.3,33.97 28.57,35.24 36.83,35.24 38.1,33.97 IC13.11 47.94,33.97 49.21,35.24 57.47,35.24 58.74,33.97 IC6.11 69.85,33.97 71.12,35.24 80.33,35.24 81.6,33.97 IC5.11 95.25,33.97 96.52,35.24 109.54,35.24 110.81,33.97 IC7.11 145.73,33.97 147.96,31.75 153.67,31.75 J1.A23
  Bottom 0.406: IC11.11 37.47,78.74 36.2,77.47 36.2,39.69 31.75,35.24 28.26,35.24 26.99,33.97 IC14.11
ABUS2
  Top 0.406: IC3.10 81.6,76.2 80.33,77.47 71.12,77.47 69.85,76.2 IC4.10 58.74,76.2 57.47,77.47 49.21,77.47 47.94,76.2 IC11.10 38.1,76.2 36.83,77.47 28.57,77.47 27.3,76.2 IC12.10 | IC14.10 27.3,31.43 28.57,32.7 36.83,32.7 38.1,31.43 IC13.10 47.94,31.43 49.21,32.7 57.47,32.7 58.74,31.43 IC6.10 69.85,31.43 71.12,32.7 80.33,32.7 81.6,31.43 IC5.10 95.25,31.43 96.52,32.7 109.54,32.7 110.81,31.43 IC7.10 147,31.43 147.96,30.48 J1.C24
  Bottom 0.406: IC11.10 38.42,76.2 37.15,74.93 37.15,38.1 31.75,32.7 28.26,32.7 26.99,31.43 IC14.10
ABUS3
  Top 0.406: IC3.9 81.6,73.66 80.33,74.93 71.12,74.93 69.85,73.66 IC4.9 58.74,73.66 57.47,74.93 49.21,74.93 47.94,73.66 IC11.9 38.1,73.66 36.83,74.93 28.57,74.93 27.3,73.66 IC12.9 | IC14.9 27.3,28.89 28.57,30.16 36.83,30.16 38.1,28.89 IC13.9 47.94,28.89 49.21,30.16 57.47,30.16 58.74,28.89 IC6.9 69.85,28.89 71.12,30.16 80.33,30.16 81.6,28.89 IC5.9 95.25,28.89 96.52,30.16 109.54,30.16 110.81,28.89 IC7.9 147,28.89 147.32,29.21 153.67,29.21 J1.A24
  Bottom 0.406: IC11.9 39.37,73.66 38.1,72.39 38.1,36.51 31.75,30.16 28.26,30.16 26.99,28.89 IC14.9
ABUS4
  Top 0.406: IC3.8 81.6,71.12 80.33,72.39 71.12,72.39 69.85,71.12 IC4.8 58.74,71.12 57.47,72.39 49.21,72.39 47.94,71.12 IC11.8 38.1,71.12 36.83,72.39 28.57,72.39 27.3,71.12 IC12.8 | IC14.8 27.3,26.35 28.57,27.62 36.83,27.62 38.1,26.35 IC13.8 47.94,26.35 49.21,27.62 57.47,27.62 58.74,26.35 IC6.8 69.85,26.35 71.12,27.62 80.33,27.62 81.6,26.35 IC5.8 95.25,26.35 96.52,27.62 109.54,27.62 110.81,26.35 IC7.8 145.73,26.35 147.32,27.94 J1.C25
  Bottom 0.406: IC11.8 40.32,71.12 39.05,69.85 39.05,34.92 31.75,27.62 28.26,27.62 26.99,26.35 IC14.8
ABUS5
  Top 0.406: IC3.7 81.6,68.58 80.33,69.85 71.12,69.85 69.85,68.58 IC4.7 58.74,68.58 57.47,69.85 49.21,69.85 47.94,68.58 IC11.7 38.1,68.58 36.83,69.85 28.57,69.85 27.3,68.58 IC12.7 | IC14.7 27.3,23.81 28.57,25.08 36.83,25.08 38.1,23.81 IC13.7 47.94,23.81 49.21,25.08 57.47,25.08 58.74,23.81 IC6.7 69.85,23.81 71.12,25.08 80.33,25.08 81.6,23.81 IC5.7 95.25,23.81 96.52,25.08 109.54,25.08 110.81,23.81 IC7.7 144.46,23.81 147.32,26.67 153.67,26.67 J1.A25
  Bottom 0.406: IC11.7 41.27,68.58 40.01,67.31 40.01,33.34 31.75,25.08 28.26,25.08 26.99,23.81 IC14.7
ABUS6
  Top 0.406: IC3.6 81.6,66.04 80.33,67.31 71.12,67.31 69.85,66.04 IC4.6 58.74,66.04 57.47,67.31 49.21,67.31 47.94,66.04 IC11.6 38.1,66.04 36.83,67.31 28.57,67.31 27.3,66.04 IC12.6 | IC14.6 27.3,21.27 28.57,22.54 36.83,22.54 38.1,21.27 IC13.6 47.94,21.27 49.21,22.54 57.47,22.54 58.74,21.27 IC6.6 69.85,21.27 71.12,22.54 80.33,22.54 81.6,21.27 IC5.6 95.25,21.27 96.52,22.54 109.54,22.54 110.81,21.27 IC7.6 143.19,21.27 147.32,25.4 J1.C26
  Bottom 0.406: IC11.6 42.23,66.04 40.96,64.77 40.96,31.75 31.75,22.54 28.26,22.54 26.99,21.27 IC14.6
ABUS7
  Top 0.406: IC3.5 81.6,63.5 80.33,64.77 71.12,64.77 69.85,63.5 IC4.5 58.74,63.5 57.47,64.77 49.21,64.77 47.94,63.5 IC11.5 38.1,63.5 36.83,64.77 28.57,64.77 27.3,63.5 IC12.5 | IC14.5 27.3,18.73 28.57,20 36.83,20 38.1,18.73 IC13.5 47.94,18.73 49.21,20 57.47,20 58.74,18.73 IC6.5 69.85,18.73 71.12,20 80.33,20 81.6,18.73 IC5.5 95.25,18.73 96.52,20 109.54,20 110.81,18.73 IC7.5 143.19,18.73 146.05,21.59 151.13,21.59 J1.A26
  Bottom 0.406: IC11.5 43.18,63.5 41.91,62.23 41.91,30.16 31.75,20 28.26,20 26.99,18.73 IC14.5
ABUS8
  Top 0.406: IC3.27 71.12,66.04 69.85,64.77 58.74,64.77 57.47,66.04 IC4.27 49.21,66.04 47.94,64.77 38.1,64.77 36.83,66.04 IC11.27 28.57,66.04 27.3,64.77 17.14,64.77 15.88,66.04 IC12.27 | IC14.27 15.88,21.27 17.14,20 27.3,20 28.57,21.27 IC13.27 36.83,21.27 38.1,20 47.94,20 49.21,21.27 IC6.27 57.47,21.27 58.74,20 69.85,20 71.12,21.27 IC5.27 80.33,21.27 81.6,20 95.25,20 96.52,21.27 IC7.27 109.54,21.27 110.81,20 143.19,20 146.05,22.86 J1.C27
  Bottom 0.406: IC11.27 28.57,66.04 27.3,64.77 20.64,64.77 19.37,63.5 19.37,31.11 9.53,21.27 IC14.27
ABUS9  (via drill 0.61 pad 1.27)
  Top 0.406: IC3.26 71.12,68.58 69.85,67.31 58.74,67.31 57.47,68.58 IC4.26 49.21,68.58 47.94,67.31 38.1,67.31 36.83,68.58 IC11.26 28.57,68.58 27.3,67.31 17.14,67.31 15.88,68.58 IC12.26 | IC14.26 15.88,23.81 17.14,22.54 27.3,22.54 28.57,23.81 IC13.26 36.83,23.81 38.1,22.54 47.94,22.54 49.21,23.81 IC6.26 57.47,23.81 58.74,22.54 69.85,22.54 71.12,23.81 IC5.26 80.33,23.81 81.6,22.54 95.25,22.54 96.52,23.81 IC7.26 109.54,23.81 110.81,22.54 v137.16,22.54
  Bottom 0.406: IC11.26 28.57,68.58 27.3,67.31 19.68,67.31 18.41,66.04 18.41,32.7 9.53,23.81 IC14.26 | v137.16,22.54 138.11,21.59 153.67,21.59 J1.A27
ABUS10  (via drill 0.61 pad 1.27)
  Top 0.406: IC3.23 71.12,76.2 69.85,74.93 58.74,74.93 57.47,76.2 IC4.23 49.21,76.2 47.94,74.93 38.1,74.93 36.83,76.2 IC11.23 28.57,76.2 27.3,74.93 17.14,74.93 15.88,76.2 IC12.23 | IC14.23 15.88,31.43 17.14,30.16 27.3,30.16 28.57,31.43 IC13.23 36.83,31.43 38.1,30.16 47.94,30.16 49.21,31.43 IC6.23 57.47,31.43 58.74,30.16 69.85,30.16 71.12,31.43 IC5.23 80.33,31.43 81.6,30.16 95.25,30.16 96.52,31.43 IC7.23 109.54,31.43 110.81,30.16 v134.94,30.16
  Bottom 0.406: IC11.23 28.57,76.2 27.3,74.93 16.83,74.93 15.56,73.66 15.56,37.47 9.53,31.43 IC14.23 | v134.94,30.16 134.94,21.91 136.53,20.32 J1.C28
ABUS11  (via drill 0.61 pad 1.27)
  Top 0.406: IC3.25 71.12,71.12 69.85,69.85 58.74,69.85 57.47,71.12 IC4.25 49.21,71.12 47.94,69.85 38.1,69.85 36.83,71.12 IC11.25 28.57,71.12 27.3,69.85 17.14,69.85 15.88,71.12 IC12.25 | IC14.25 15.88,26.35 17.14,25.08 27.3,25.08 28.57,26.35 IC13.25 36.83,26.35 38.1,25.08 47.94,25.08 49.21,26.35 IC6.25 57.47,26.35 58.74,25.08 69.85,25.08 71.12,26.35 IC5.25 80.33,26.35 81.6,25.08 95.25,25.08 96.52,26.35 IC7.25 109.54,26.35 110.81,25.08 v132.08,25.08
  Bottom 0.406: IC11.25 28.57,71.12 27.3,69.85 18.73,69.85 17.46,68.58 17.46,34.29 9.53,26.35 IC14.25 | v132.08,25.08 132.08,20.64 133.67,19.05 153.67,19.05 J1.A28
DBUS0
  Top 0.406: J1.C3 136.53,83.82 135.25,85.09 IC1.2
DBUS1
  Top 0.406: J1.C4 136.53,81.28 135.25,82.55 IC1.3
DBUS2
  Top 0.406: J1.C5 136.53,78.74 135.25,80.01 IC1.4
DBUS3
  Top 0.406: J1.C6 136.53,76.2 135.25,77.47 IC1.5
DBUS4
  Top 0.406: J1.C7 136.53,73.66 135.25,74.93 IC1.6
DBUS5
  Top 0.406: J1.C8 136.53,71.12 135.25,72.39 IC1.7
DBUS6
  Top 0.406: J1.C9 136.53,68.58 135.25,69.85 IC1.8
DBUS7
  Top 0.406: J1.C10 136.53,66.04 135.25,67.31 IC1.9
GND
  Top 0.406: IC7.16 110.81,46.67 109.54,47.94 96.52,47.94 95.25,46.67 IC5.16 81.6,46.67 80.33,47.94 71.12,47.94 69.85,46.67 IC6.16 58.74,46.67 57.47,47.94 49.21,47.94 47.94,46.67 IC13.16 38.1,46.67 36.83,47.94 28.57,47.94 27.3,46.67 IC14.16
  Bottom 0.406: IC8.13 133.99,52.39 131.44,54.93 127,54.93 123.83,58.1 IC8.8
  pour Bottom (isolate 0.61): 0,100.01 14.92,100.01 160.34,100.01 160.34,85.09 160.34,-0.32 0,-0.32
  pour Top (isolate 0.61): 0,100.01 160.34,100.01 160.34,-0.32 0,-0.32
IDBUS0
  Top 0.406: IC1.18 RN1.2 | IC3.13 81.6,83.82 80.33,85.09 71.12,85.09 69.85,83.82 IC4.13 58.74,83.82 57.47,85.09 49.21,85.09 47.94,83.82 IC11.13 38.1,83.82 36.83,85.09 28.57,85.09 27.3,83.82 IC12.13 | IC14.13 27.3,39.05 28.57,40.32 36.83,40.32 38.1,39.05 IC13.13 47.94,39.05 49.21,40.32 57.47,40.32 58.74,39.05 IC6.13 69.85,39.05 71.12,40.32 80.33,40.32 81.6,39.05 IC5.13 95.25,39.05 96.52,40.32 109.54,40.32 110.81,39.05 IC7.13
  Bottom 0.406: IC1.18 136.53,82.55 135.25,81.28 94.3,81.28 91.76,83.82 IC3.13 | IC11.13 35.56,83.82 34.29,82.55 34.29,42.86 31.75,40.32 28.26,40.32 26.99,39.05 IC14.13
IDBUS1
  Top 0.406: IC1.17 RN1.3 | IC3.14 81.6,86.36 80.33,87.63 71.12,87.63 69.85,86.36 IC4.14 58.74,86.36 57.47,87.63 49.21,87.63 47.94,86.36 IC11.14 38.1,86.36 36.83,87.63 28.57,87.63 27.3,86.36 IC12.14 | IC14.14 27.3,41.59 28.57,42.86 36.83,42.86 38.1,41.59 IC13.14 47.94,41.59 49.21,42.86 57.47,42.86 58.74,41.59 IC6.14 69.85,41.59 71.12,42.86 80.33,42.86 81.6,41.59 IC5.14 95.25,41.59 96.52,42.86 109.54,42.86 110.81,41.59 IC7.14
  Bottom 0.406: IC1.17 140.65,80.01 141.6,80.96 141.6,83.19 140.97,83.82 93.66,83.82 91.12,86.36 IC3.14 | IC11.14 34.61,86.36 33.34,85.09 33.34,44.45 31.75,42.86 28.26,42.86 26.99,41.59 IC14.14
IDBUS2
  Top 0.406: IC1.16 RN1.4 | IC3.15 81.6,88.9 80.33,90.17 71.12,90.17 69.85,88.9 IC4.15 58.74,88.9 57.47,90.17 49.21,90.17 47.94,88.9 IC11.15 38.1,88.9 36.83,90.17 28.57,90.17 27.3,88.9 IC12.15 | IC14.15 27.3,44.13 28.57,45.4 36.83,45.4 38.1,44.13 IC13.15 47.94,44.13 49.21,45.4 57.47,45.4 58.74,44.13 IC6.15 69.85,44.13 71.12,45.4 80.33,45.4 81.6,44.13 IC5.15 95.25,44.13 96.52,45.4 109.54,45.4 110.81,44.13 IC7.15
  Bottom 0.406: IC1.16 140.97,77.47 142.56,79.06 142.56,84.77 140.97,86.36 93.66,86.36 91.12,88.9 IC3.15 | IC11.15 33.66,88.9 32.38,87.63 32.38,46.04 31.75,45.4 28.26,45.4 26.99,44.13 IC14.15
IDBUS3
  Top 0.406: IC1.15 RN1.5 | IC3.17 71.12,91.44 69.85,90.17 58.74,90.17 57.47,91.44 IC4.17 49.21,91.44 47.94,90.17 38.1,90.17 36.83,91.44 IC11.17 28.26,91.44 26.99,90.17 17.14,90.17 15.88,91.44 IC12.17 | IC14.17 15.88,46.67 17.14,45.4 27.3,45.4 28.57,46.67 IC13.17 36.83,46.67 38.1,45.4 47.94,45.4 49.21,46.67 IC6.17 57.47,46.67 58.74,45.4 69.85,45.4 71.12,46.67 IC5.17 80.33,46.67 81.6,45.4 95.25,45.4 96.52,46.67 IC7.17
  Bottom 0.406: IC1.15 137.48,74.93 133.67,78.74 94.93,78.74 91.12,82.55 86.68,82.55 77.79,91.44 IC3.17 | IC11.17 28.26,91.44 26.99,90.17 12.06,90.17 10.79,88.9 10.79,47.94 9.53,46.67 IC14.17
IDBUS4
  Top 0.406: IC1.14 RN1.6 | IC3.18 71.12,88.9 69.85,87.63 58.74,87.63 57.47,88.9 IC4.18 49.21,88.9 47.94,87.63 38.1,87.63 36.83,88.9 IC11.18 28.57,88.9 27.3,87.63 17.14,87.63 15.88,88.9 IC12.18 | IC14.18 15.88,44.13 17.14,42.86 27.3,42.86 28.57,44.13 IC13.18 36.83,44.13 38.1,42.86 47.94,42.86 49.21,44.13 IC6.18 57.47,44.13 58.74,42.86 69.85,42.86 71.12,44.13 IC5.18 80.33,44.13 81.6,42.86 95.25,42.86 96.52,44.13 IC7.18
  Bottom 0.406: IC1.14 137.48,72.39 133.67,76.2 94.93,76.2 91.12,80.01 86.68,80.01 77.79,88.9 IC3.18 | IC11.18 28.57,88.9 27.3,87.63 13.02,87.63 11.75,86.36 11.75,46.35 9.53,44.13 IC14.18
IDBUS5
  Top 0.406: IC1.13 RN1.7 | IC3.19 71.12,86.36 69.85,85.09 58.74,85.09 57.47,86.36 IC4.19 49.21,86.36 47.94,85.09 38.1,85.09 36.83,86.36 IC11.19 28.57,86.36 27.3,85.09 17.14,85.09 15.88,86.36 IC12.19 | IC14.19 15.88,41.59 17.14,40.32 27.3,40.32 28.57,41.59 IC13.19 36.83,41.59 38.1,40.32 47.94,40.32 49.21,41.59 IC6.19 57.47,41.59 58.74,40.32 69.85,40.32 71.12,41.59 IC5.19 80.33,41.59 81.6,40.32 95.25,40.32 96.52,41.59 IC7.19
  Bottom 0.406: IC1.13 137.48,69.85 133.67,73.66 94.93,73.66 91.12,77.47 86.68,77.47 77.79,86.36 IC3.19 | IC11.19 28.57,86.36 27.3,85.09 13.97,85.09 12.7,83.82 12.7,44.77 9.53,41.59 IC14.19
IDBUS6
  Top 0.406: IC1.12 RN1.8 | IC3.20 71.12,83.82 69.85,82.55 58.74,82.55 57.47,83.82 IC4.20 49.21,83.82 47.94,82.55 38.1,82.55 36.83,83.82 IC11.20 28.57,83.82 27.3,82.55 17.14,82.55 15.88,83.82 IC12.20 | IC14.20 15.88,39.05 17.14,37.78 27.3,37.78 28.57,39.05 IC13.20 36.83,39.05 38.1,37.78 47.94,37.78 49.21,39.05 IC6.20 57.47,39.05 58.74,37.78 69.85,37.78 71.12,39.05 IC5.20 80.33,39.05 81.6,37.78 95.25,37.78 96.52,39.05 IC7.20
  Bottom 0.406: IC1.12 137.48,67.31 133.67,71.12 94.93,71.12 91.12,74.93 86.68,74.93 77.79,83.82 IC3.20 | IC11.20 28.57,83.82 27.3,82.55 14.92,82.55 13.65,81.28 13.65,43.18 9.53,39.05 IC14.20
IDBUS7
  Top 0.406: IC1.11 RN1.9 | IC3.21 71.12,81.28 69.85,80.01 58.74,80.01 57.47,81.28 IC4.21 49.21,81.28 47.94,80.01 38.1,80.01 36.83,81.28 IC11.21 28.57,81.28 27.3,80.01 17.14,80.01 15.88,81.28 IC12.21 | IC14.21 15.88,36.51 17.14,35.24 27.3,35.24 28.57,36.51 IC13.21 36.83,36.51 38.1,35.24 47.94,35.24 49.21,36.51 IC6.21 57.47,36.51 58.74,35.24 69.85,35.24 71.12,36.51 IC5.21 80.33,36.51 81.6,35.24 95.25,35.24 96.52,36.51 IC7.21
  Bottom 0.406: IC1.11 137.48,64.77 133.67,68.58 95.89,68.58 92.08,72.39 86.68,72.39 77.79,81.28 IC3.21 | IC11.21 28.57,81.28 27.3,80.01 15.88,80.01 14.61,78.74 14.61,41.59 9.53,36.51 IC14.21
N$1
  Top 0.406: IC1.19 136.53,85.09 135.25,86.36 117.47,86.36 116.52,85.41 116.52,78.42 117.47,77.47 IC2.2
N$3
  Top 0.406: IC10.15 110.81,52.39 113.35,54.93 132.72,54.93 134.3,56.52 134.62,56.83 135.25,57.47 135.25,60.64 136.21,61.59 140.65,61.59 141.6,60.64 IC8.1
N$4
  Top 0.406: IC8.5 131.44,60.33 128.27,63.5 111.12,63.5 110.49,64.14 110.49,77.79 108.27,80.01 IC9.1
N$5
  Top 0.406: IC8.6 128.91,60.33 126.68,62.55 110.81,62.55 109.54,63.82 109.54,75.25 107.31,77.47 IC9.2
N$6
  Bottom 0.406: IC7.22 102.87,33.97 111.76,42.86 132.4,42.86 135.25,45.72 135.25,53.98 133.99,55.24 133.99,56.52 133.99,56.83 IC8.4
N$7
  Top 0.406: IC8.7 126.36,60.33 125.09,61.59 110.49,61.59 108.58,63.5 108.58,67.63 106.36,69.85 IC9.5
N$8
  Top 0.406: IC9.4 IC9.3
PABUS12  (via drill 0.61 pad 1.27)
  Top 0.406: IC3.4 81.6,60.96 80.33,62.23 71.12,62.23 69.85,60.96 IC4.4 58.74,60.96 57.47,62.23 49.21,62.23 47.94,60.96 IC11.4 38.1,60.96 36.83,62.23 28.57,62.23 27.3,60.96 IC12.4 | IC14.4 27.3,16.19 28.57,17.46 36.83,17.46 38.1,16.19 IC13.4 47.94,16.19 49.21,17.46 57.47,17.46 58.74,16.19 IC6.4 69.85,16.19 71.12,17.46 80.33,17.46 81.6,16.19 IC5.4 95.25,16.19 96.52,17.46 109.54,17.46 110.81,16.19 IC7.4 v119.38,16.19
  Bottom 0.406: IC11.4 44.13,60.96 42.86,59.69 42.86,28.57 31.75,17.46 28.26,17.46 26.99,16.19 IC14.4 | J1.C15 149.22,53.34 136.21,40.32 125.41,40.32 119.38,34.29 v119.38,16.19
PABUS13  (via drill 0.61 pad 1.27)
  Top 0.406: IC3.28 71.12,63.5 69.85,62.23 58.74,62.23 57.47,63.5 IC4.28 49.21,63.5 47.94,62.23 38.1,62.23 36.83,63.5 IC11.28 28.57,63.5 27.3,62.23 17.14,62.23 15.88,63.5 IC12.28 | IC14.28 15.88,18.73 17.14,17.46 27.3,17.46 28.57,18.73 IC13.28 36.83,18.73 38.1,17.46 47.94,17.46 49.21,18.73 IC6.28 57.47,18.73 58.74,17.46 69.85,17.46 71.12,18.73 IC5.28 80.33,18.73 81.6,17.46 95.25,17.46 96.52,18.73 IC7.28 109.54,18.73 110.81,17.46 v120.65,17.46
  Bottom 0.406: IC11.28 28.57,63.5 27.3,62.23 21.59,62.23 20.32,60.96 20.32,29.53 9.53,18.73 IC14.28 | J1.A15 153.67,52.07 149.22,52.07 136.53,39.37 125.73,39.37 120.65,34.29 v120.65,17.46
PABUS14  (via drill 0.61 pad 1.27)
  Top 0.406: IC3.3 81.6,58.42 80.33,59.69 71.12,59.69 69.85,58.42 IC4.3 58.74,58.42 57.47,59.69 49.21,59.69 47.94,58.42 IC11.3 38.1,58.42 36.83,59.69 28.57,59.69 27.3,58.42 IC12.3 | IC14.3 27.3,13.65 28.57,14.92 36.83,14.92 38.1,13.65 IC13.3 47.94,13.65 49.21,14.92 57.47,14.92 58.74,13.65 IC6.3 69.85,13.65 71.12,14.92 80.33,14.92 81.6,13.65 IC5.3 | IC7.29 109.54,16.19 110.81,14.92 v121.92,14.92
  Bottom 0.406: IC11.3 45.09,58.42 43.81,57.15 43.81,26.99 31.75,14.92 28.26,14.92 26.99,13.65 IC14.3 | IC5.3 95.25,13.65 97.79,16.19 IC7.29 | J1.C16 149.22,50.8 136.84,38.42 126.05,38.42 121.92,34.29 v121.92,14.92
PABUS15  (via drill 0.61 pad 1.27)
  Top 0.406: IC3.31 71.12,55.88 69.85,54.61 58.74,54.61 57.47,55.88 IC4.31 49.21,55.88 47.94,54.61 38.1,54.61 36.83,55.88 IC11.31 28.57,55.88 27.3,54.61 17.14,54.61 15.88,55.88 IC12.31 | IC14.31 15.88,11.11 17.14,9.84 27.3,9.84 28.57,11.11 IC13.31 36.83,11.11 38.1,9.84 47.94,9.84 49.21,11.11 IC6.31 57.47,11.11 58.74,9.84 69.85,9.84 71.12,11.11 IC5.31 80.33,11.11 81.6,9.84 v113.67,9.84 | IC7.3 v123.19,13.65
  Bottom 0.406: J1.A16 153.67,49.53 149.22,49.53 137.16,37.47 126.36,37.47 123.19,34.29 v123.19,13.65 | v113.67,9.84 113.67,12.38 114.94,13.65 IC7.3 | IC3.31 72.71,55.88 71.75,54.93 71.75,12.06 72.71,11.11 IC5.31
PABUS16  (via drill 0.61 pad 1.27)
  Top 0.406: IC3.2 81.6,55.88 80.33,57.15 71.12,57.15 69.85,55.88 IC4.2 58.74,55.88 57.47,57.15 49.21,57.15 47.94,55.88 IC11.2 38.1,55.88 36.83,57.15 28.57,57.15 27.3,55.88 IC12.2 | IC14.2 27.3,11.11 28.57,12.38 36.83,12.38 38.1,11.11 IC13.2 47.94,11.11 49.21,12.38 57.47,12.38 58.74,11.11 IC6.2 69.85,11.11 71.12,12.38 80.33,12.38 81.6,11.11 IC5.2 95.25,11.11 96.52,12.38 109.54,12.38 110.81,11.11 IC7.2 v124.46,11.11
  Bottom 0.406: IC13.2 46.35,11.11 47.62,12.38 47.62,54.61 46.35,55.88 IC11.2 | J1.C17 149.22,48.26 137.48,36.51 126.68,36.51 124.46,34.29 v124.46,11.11
PABUS17
  Top 0.406: IC3.30 71.12,58.42 69.85,57.15 58.74,57.15 57.47,58.42 IC4.30 49.21,58.42 47.94,57.15 38.1,57.15 36.83,58.42 IC11.30 28.57,58.42 27.3,57.15 17.14,57.15 15.88,58.42 IC12.30 | IC14.30 15.88,13.65 17.14,12.38 27.3,12.38 28.57,13.65 IC13.30 36.83,13.65 38.1,12.38 47.94,12.38 49.21,13.65 IC6.30 57.47,13.65 58.74,12.38 69.85,12.38 71.12,13.65 IC5.30 | J1.A17 153.67,49.53 147.32,49.53 139.06,57.78 IC8.2
  Bottom 0.406: IC11.30 28.57,58.42 27.3,57.15 22.86,57.15 22.23,56.52 22.23,26.35 9.53,13.65 IC14.30 | J1.A17 153.67,46.99 149.22,46.99 137.79,35.56 127,35.56 125.73,34.29 125.73,9.53 123.51,7.3 110.81,7.3 103.19,14.92 97.79,14.92 95.25,12.38 81.6,12.38 80.33,13.65 IC5.30
PABUS18
  Top 0.406: IC3.1 81.6,53.34 80.33,54.61 71.12,54.61 69.85,53.34 IC4.1 58.74,53.34 57.47,54.61 49.21,54.61 47.94,53.34 IC11.1 38.1,53.34 36.83,54.61 28.57,54.61 27.3,53.34 IC12.1 | IC14.1 27.3,8.57 28.57,9.84 36.83,9.84 38.1,8.57 IC13.1 47.94,8.57 49.21,9.84 57.47,9.84 58.74,8.57 IC6.1 69.85,8.57 71.12,9.84 80.33,9.84 81.6,8.57 IC5.1 | J1.C18 IC8.3
  Bottom 0.406: IC6.1 67.94,8.57 69.22,9.84 69.22,52.39 68.26,53.34 IC4.1 | J1.C18 149.22,45.72 138.11,34.61 127.32,34.61 126.68,33.97 126.68,9.21 123.83,6.35 109.22,6.35 103.19,12.38 99.06,12.38 95.25,8.57 IC5.1
PABUS19
  Bottom 0.406: IC10.1 113.35,60.01 114.94,61.59 146.37,61.59 148.27,59.69 155.57,59.69 156.21,59.05 156.21,46.99 J1.A18
PABUS20
  Bottom 0.406: IC10.2 110.81,60.01 113.35,62.55 147,62.55 147.32,62.23 156.21,62.23 157.16,61.28 157.16,45.72 155.89,44.45 151.13,44.45 J1.C19
PABUS21
  Bottom 0.406: IC10.3 108.27,60.01 111.76,63.5 147,63.5 148.27,64.77 156.21,64.77 158.12,62.87 158.12,45.4 155.89,43.18 J1.A19

### Text on the board
tsilk: IC1 | 5 | 4 | 1 | 0 | 4k7 | 74LS245N | IC9 | IC2 | 74LS08N | 74LS04N | IC8 | 74LS138N | 74LS139N | 628512 | 628512 | 628512 | 628512 | IC10 | IC12 | IC11 | IC4 | IC3 | ROM | 7 | 6 | 3 | 2 | 628512 | 628512 | 628512 | 628512 | AM29F010 | IC14 | IC13 | IC6 | IC5 | IC7 | 10u | Memory Card ver. 2.0, BYTEC/16 Homebrew Computer, D.Pilawa